# Altium schematic sheet MotorDriver.SchDoc
size A4; SheetNumber: 4; SheetTotal: 4
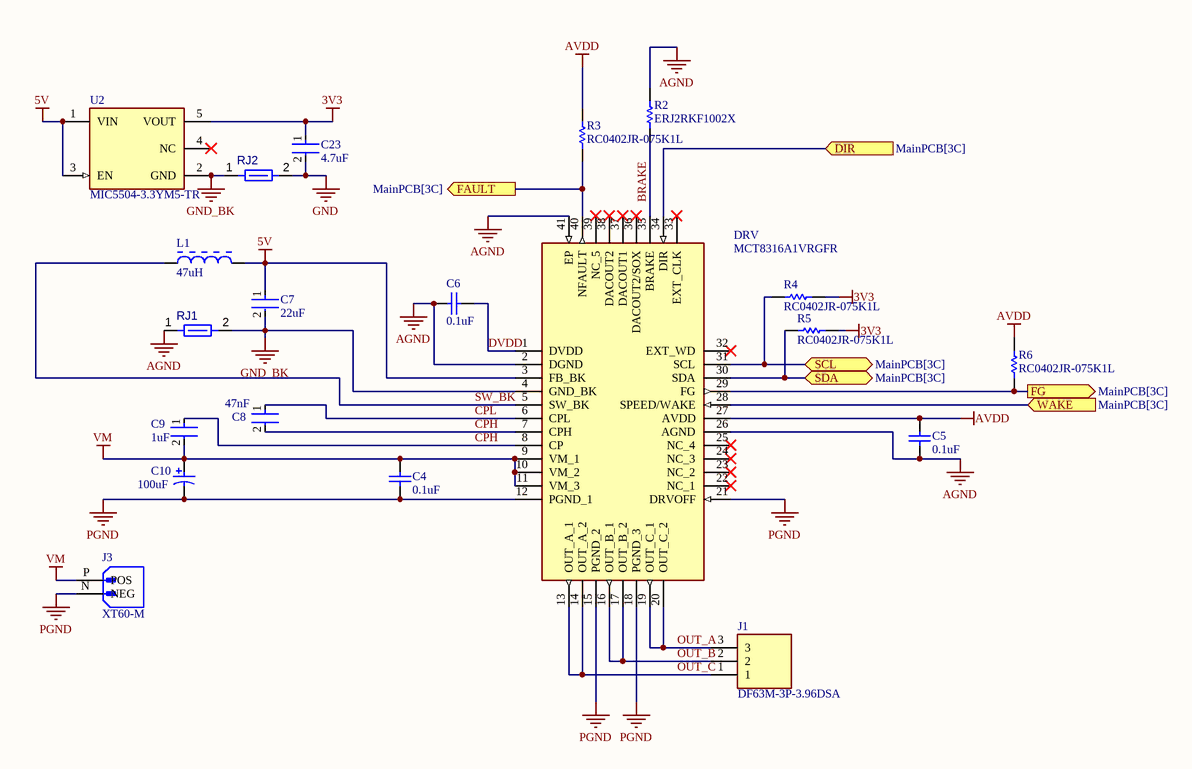
[diagram p0: MotorDriver.SchDoc]

## Parts
C4  0.1uF  [CAPC1005X56X25LL10T15]
C5  0.1uF  [CAPC1005X56X25LL10T15]
C6  0.1uF  [CAPC1005X56X25LL10T15]
C7  22uF  [FP-1206-L_3_2_0_2-W_1_6_0-IPC_C]
C8  47nF  [FP-CC0402-MFG]
C9  1uF  [FP-C1005-050-0_05-IPC_C]
C10  100uF  [PNSC-FK-V-D8_V]
C23  4.7uF  [FP-C1005-050-0_15-MFG]
DRV  MCT8316A1VRGFR  [QFN50P500X700X100-41N-D]
J1  DF63M-3P-3.96DSA  [DF63M3P396DSA]
J3  XT60-M  [AMASS_XT60-M]
L1  47uH  [BOUR-SRN3015-2_V]
R2  ERJ2RKF1002X  [RESC1005X40X25LL05T05]
R3  RC0402JR-075K1L  [RESC1005X40X25ML05T10]
R4  RC0402JR-075K1L  [RESC1005X40X25ML05T10]
R5  RC0402JR-075K1L  [RESC1005X40X25ML05T10]
R6  RC0402JR-075K1L  [RESC1005X40X25ML05T10]
RJ1  Net Tie 10x8mil  [New footprint 1]  (value not drawn)  (net tie, no BOM)
RJ2  Net Tie 10x8mil  [New footprint 1]  (value not drawn)  (net tie, no BOM)
U2  MIC5504-3.3YM5-TR  [FP-SOT23-5LD-PL-1-MFG]

## Ports
DIR (in, see MainPCB[3C]), FAULT (out, see MainPCB[3C]), FG (out, see MainPCB[3C]), SCL (bidir, see MainPCB[3C]), SDA (bidir, see MainPCB[3C]), WAKE (in, see MainPCB[3C])

## Nets
3V3: C23.1 R4.2 R5.2 U2.5(VOUT)
5V: C7.1 DRV.3(FB_BK) L1.2 U2.1(VIN) U2.3(EN)
AGND: C5.1 C6.1 DRV.2(DGND) DRV.26(AGND) DRV.41(EP) R2.2 RJ1.1
AVDD: C5.2 DRV.27(AVDD) R3.1 R6.2
GND: C23.2 RJ2.2
GND_BK: C7.2 DRV.4(GND_BK) RJ1.2 RJ2.1 U2.2(GND)
PGND: C4.1 C10.2 DRV.12(PGND_1) DRV.15(PGND_2) DRV.18(PGND_3) DRV.21(DRVOFF) J3.N(NEG)
VM: C4.2 C9.2 C10.1 DRV.9(VM_1) DRV.10(VM_2) DRV.11(VM_3) J3.P(POS)
BRAKE: DRV.35(BRAKE) R2.1
CPH: C8.2 C9.1 DRV.7(CPH) DRV.8(CP)
CPL: C8.1 DRV.6(CPL)
DIR: DRV.34(DIR) ; port DIR
DVDD: C6.2 DRV.1(DVDD)
FAULT: DRV.40(NFAULT) R3.2 ; port FAULT
FG: DRV.29(FG) R6.1 ; port FG
OUT_A: DRV.19(OUT_C_1) DRV.20(OUT_C_2) J1.3
OUT_B: DRV.16(OUT_B_1) DRV.17(OUT_B_2) J1.2
OUT_C: DRV.13(OUT_A_1) DRV.14(OUT_A_2) J1.1
SCL: DRV.31(SCL) R4.1 ; port SCL
SDA: DRV.30(SDA) R5.1 ; port SDA
SW_BK: DRV.5(SW_BK) L1.1
WAKE: DRV.28(SPEED/WAKE) ; port WAKE

Not connected (* = marked no-connect by the designer): DRV 22(NC_1)* 23(NC_2)* 24(NC_3)* 25(NC_4)* 32(EXT_WD)* 33(EXT_CLK)* 36(DACOUT2/SOX)* 37(DACOUT1)* 38(DACOUT2)* 39(NC_5)*; U2 4(NC)*

## Library data of the parts
C4-C6 = CMP-2008-02972-1: 04023C104JAT2A; Manufacturer: AVX Interconnect / Elco; Part Number: 04023C104JAT2A
C7 = CMP-2000-05869-2: 12066D226MAT2A; Tolerance: 20%; Voltage Rating: 6.3V; Dielectric: X5R; Lead Free: Lead Free; Case Code (Metric): 3216; Case/Package: 1206; Depth: 1.6mm; Capacitance: 22uF; Length: 3.2mm; Series: -; Contact Plating: Tin; REACH SVHC: No SVHC; Radiation Hardening: No; RoHS Compliant: Yes; Termination: SMD/SMT; Packaging: Tape and Reel; Voltage: 6.3V; Mount: Surface Mount; Thickness: 0.07inch; Package Quantity: 1; Voltage Rating (DC): 6.3V; Case Code (Imperial): 1206; Construction: Flat; Number of Pins: 2; Min Operating Temperature: -55°C; Height: 0.07mm; Width: 0.063inch; Max Operating Temperature: 85°C
C8 = CMP-03422-000813-1: CC0402KRX7R8BB473; Manufacturer: YAGEO; Automotive Grade: NA; Voltage Rating: 25 V; Temperature Coefficient: 30ppm/°C; Temperature Characteristic: X7R; Material: Ceramic; Tolerance: 0.1; Temperature: -55°C to +125°C; Category: Cap; Manufacturer Part Number: CC0402KRX7R8BB473; Digikey Description: CAP CER 0.047UF 25V X7R 0402; Device Class L1: Passive Components; Device Class L3: Ceramic Capacitors; Ipc Land Pattern Name: CAPC10050X50; Value: 47 nF; Temperature Range High: +125°C; ComponentLink2URL: http://www.yageo.com/documents/recent/UPY-GP_NP0_16V-to-50V_16.pdf; Automotive: No; Temperature Range Low: -55°C; Package: CC0402; RoHS: TRUE; Height: 0.55mm; Device Class L2: Capacitors; Capacitance: 47 nF; Octopart: https://octopart.com/cc0402krx7r8bb473-yageo-22850998; Lead Free: Yes; Mouser Description: Multilayer Ceramic Capacitors MLCC - SMD/SMT 47nF 25V X7R 10%; Footprint Url: http://www.yageo.com/exep/pages/download/literatures/UPY-C_GEN_24.pdf; ComponentLink2Description: Datasheet
C9 = CMP-2000-06004-2: C1005X5R1V105K050BC; Voltage Rating (DC): 35V; Dielectric Material: Ceramic; Dielectric: X5R; Tolerance: 10%; Series: C; Capacitance: 1uF; Max Operating Temperature: 85°C; Resistor Type: Ceramic; REACH SVHC: No SVHC; Package Quantity: 1; Packaging: Tape and Reel; Termination: SMD/SMT; Height: 0.5mm; Length: 1mm; Min Operating Temperature: -55°C; Thickness: 0.022inch; Lead Free: Lead Free; Voltage Rating: 35V; Width: 0.02inch; Depth: 0.5mm; Case Code (Imperial): 0402; Case/Package: 0402; Weight: 2.3E-05oz; Radiation Hardening: No; RoHS Compliant: Yes; Case Code (Metric): 1005; Mount: Surface Mount
C10 = CMP-2000-06206-1: EEEFK1E101XP; Manufacturer: Panasonic; Type: Can; Lifetime@Temperature: 2000Hrs@105°C; Capacitance: 100µF; Rated Voltage: 25V; Ripple Current: 280mA; Impedance: 0.34O; Case Size/Dimension: Ø6.3x7.7mm; Operating Temp-Max: 105°C; Series: FK; Package URL: http://industrial.panasonic.com/cdbs/www-data/pdf/RDE0000/DME0000COL48.pdf; Mounting Technology: SurfaceMount; Package Description: 2-Pin Electrolytic Aluminum Capacitor, Body 6.6 x 6.6 mm; Datasheet Version: 03/2016; Datasheet URL: http://industrial.panasonic.com/cdbs/www-data/pdf/RDE0000/ABA0000C1181.pdf; Manufacturer URL: http://www.panasonic.com/; Package Reference: FK-V-D8; Operating Temp Range: -55to+105°C
C23 = CMP-2000-05997-2: CAP CER 4.7UF 10V X5R 0402 C1005X5R1A475K050BC; Dielectric Material: Ceramic; Tolerance: 10%; Series: C; Package Quantity: 10000; Max Operating Temperature: 85°C; Case Code (Imperial): 0402; Lead Free: Lead Free; Voltage Rating (DC): 10V; Packaging: Cut Tape; Voltage Rating: 10V; Min Operating Temperature: -55°C; Dielectric: X5R; Thickness: 0.022inch; Width: 0.02inch; Case/Package: 0402; Case Code (Metric): 1005; Capacitance: 4.7uF; Length: 0.039inch; RoHS Compliant: Yes; REACH SVHC: No SVHC; Mount: Surface Mount
DRV = MCT8316A1VRGFR: Integrated Circuit; Manufacturer_Name: Texas Instruments; Datasheet Link: https://www.ti.com/lit/gpn/mct8316a; Height: 1mm; Manufacturer_Part_Number: MCT8316A1VRGFR; Mouser Part Number: 595-MCT8316A1VRGFR; Mouser Price/Stock: https://www.mouser.co.uk/ProductDetail/Texas-Instruments/MCT8316A1VRGFR?qs=rSMjJ%252B1ewcSMvl4Q8e7VVQ%3D%3D; Arrow Part Number: MCT8316A1VRGFR; Arrow Price/Stock: https://www.arrow.com/en/products/mct8316a1vrgfr/texas-instruments?region=nac
J1 = DF63M-3P-3.96DSA: Connector; Manufacturer_Name: Hirose; Datasheet Link: https://componentsearchengine.com/Datasheets/1/DF63M-3P-3.96DSA.pdf; Height: 10mm; Manufacturer_Part_Number: DF63M-3P-3.96DSA; Mouser Part Number: 798-DF63M-3P-3.96DSA; Mouser Price/Stock: https://www.mouser.co.uk/ProductDetail/Hirose-Connector/DF63M-3P-3.96DSA?qs=T3oQrply3y%2FuoC7pM2eZEQ%3D%3D
J3 = XT60-M: Plug; DC supply; XT60; male; PIN: 2; for cable; soldered; 30A; 500V; MF: AMASS; Price: None; Availability: Not in stock; Package: Package; MP: XT60-M; Value: *; SnapEDA_Link: https://www.snapeda.com/parts/XT60-M/AMASS/view-part/?ref=snap; Check_prices: https://www.snapeda.com/parts/XT60-M/AMASS/view-part/?ref=eda
L1 = CMP-0007-00006-1: SRN3015-470M; Manufacturer: Bourns; DCR Max: 1.406 Ohm; Packing: Tape and Reel; Isat: 0.38 A; Rated current: 0.4 A; Inductance tolerance: +/- 20%; SRF Min: 18 MHz; Resistance to Solder Heat: +260 degC for 10 sec.; ComponentLink1URL: http://www.bourns.com/; ComponentLink1Description: Manufacturer URL; ComponentLink2Description: Datasheet; PackageDescription: 2-Pin SMD, Body 3 x 3 mm, Height 1.5 mm; Inductance: 47 uH; PackageReference: SRN3015; Mounting Technology: Surface Mount; DatasheetVersion: Aug-11; RoHS: TRUE; ComponentLink3URL: http://www.bourns.com/data/global/pdfs/SRN3015.pdf; PartNumber: SRN3015-470M; ComponentLink2URL: http://www.bourns.com/data/global/pdfs/SRN3015.pdf; Operating Temperature: -40 to 125 degC; ComponentLink3Description: Package Specification
R2 = CMP-2000-07588-1: Chip Resistor, 10 KOhm, +/- 1%, 0.1 W, -55 to 155 degC, 0402 (1005 Metric), RoHS, Tape and Reel; Manufacturer: Panasonic; Power Rating: 100mW; Voltage Rating: 50V; Resistance: 10KOhm; Case\/Package: 0402; Temperature Coefficient: 100ppm\/degreesC; RoHSCompliant: True; Lead Free: LeadFree; Package Quantity: 1; Contact Plating: Tin; Length: 1mm; Radiation Hardening: No; REACH SVHC: NoSVHC; Max Operating Temperature: 155degC; Depth: 0.5mm; Case Code (Imperial): 0402; Military Standard: Not; Package Description: 2-Pin Surface Mount Device, Body 1 x 0.5 mm; Termination: SMD/SMT; Case Code (Metric): 1005; Height: 0.35mm; Packaging: TapeandReel; Voltage Rating (DC): 50V; Package Reference: 402; Number of Pins: 2; Tolerance: 1%; Mounting Technology: SurfaceMount; Width: 0.02inch; Mount: SurfaceMount; Datasheet URL: https://industrial.panasonic.com/cdbs/www-data/pdf/RDA0000/AOA0000C304.pdf; Composition: ThickFilm; Datasheet Version: 02/2017; Manufacturer URL: http://www.panasonic.com/; Max Power Dissipation: 100mW; Number of Terminations: 2; Min Operating Temperature: -55degC
R3-R6 = CMP-2002-08025-1: Manufacturer: Yageo / Phycomp; Part Number: RC0402JR-075K1L
RJ1 RJ2 = CMP-009-00116-2: Min Operating Temperature: -55°C; Pins: 2; Max Operating Temperature: 155°C
U2 = CMP-2000-07604-2: IC REG LINEAR 3.3V 300MA SOT23-5; Quiescent Current: 38uA; Operating Supply Current: 42uA; Max Input Voltage: 5.5V; Min Input Voltage: 2.5V; Output Type: Fixed; Power Supply Rejection Ratio (PSRR): 60dB; Dropout Voltage: 380mV; Accuracy: 3%; Number of Outputs: 1; Nominal Output Voltage: 3.3V; Max Output Current: 300mA; Length: 2.9mm; Mount: Surface Mount; Width: 1.6mm; Packaging: Tape and Reel; Output Current: 300mA; Min Operating Temperature: -40°C; Max Operating Temperature: 125°C; Height: 1.1mm; Case/Package: SOT-23-5; REACH SVHC: No SVHC; Number of Pins: 5; Output Voltage: 3.3V